# EAGLE schematic H3-Rev_A (EAGLE 9.6.2)
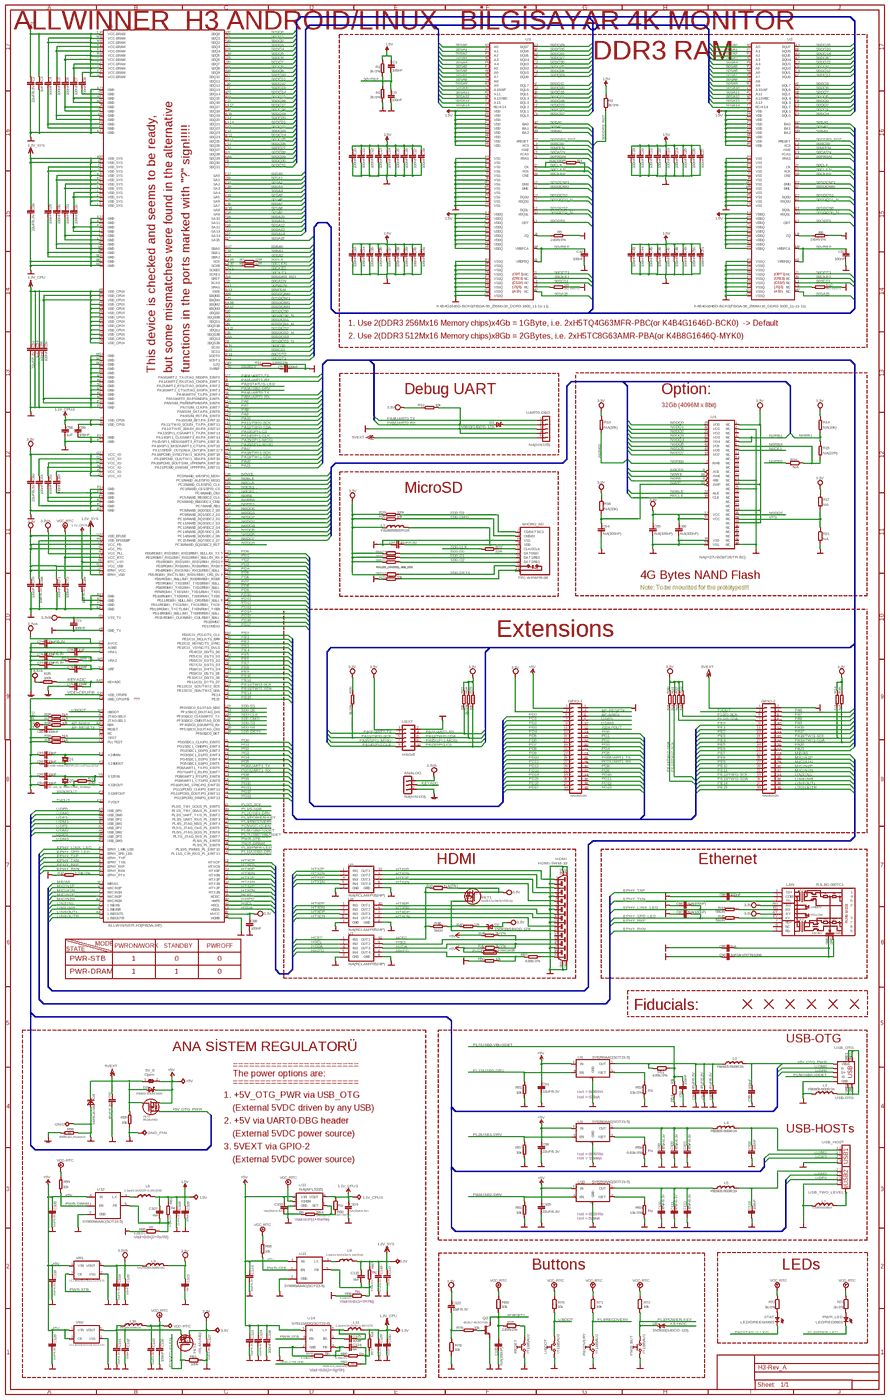
[diagram p0: schematic, sheet 1, overview]
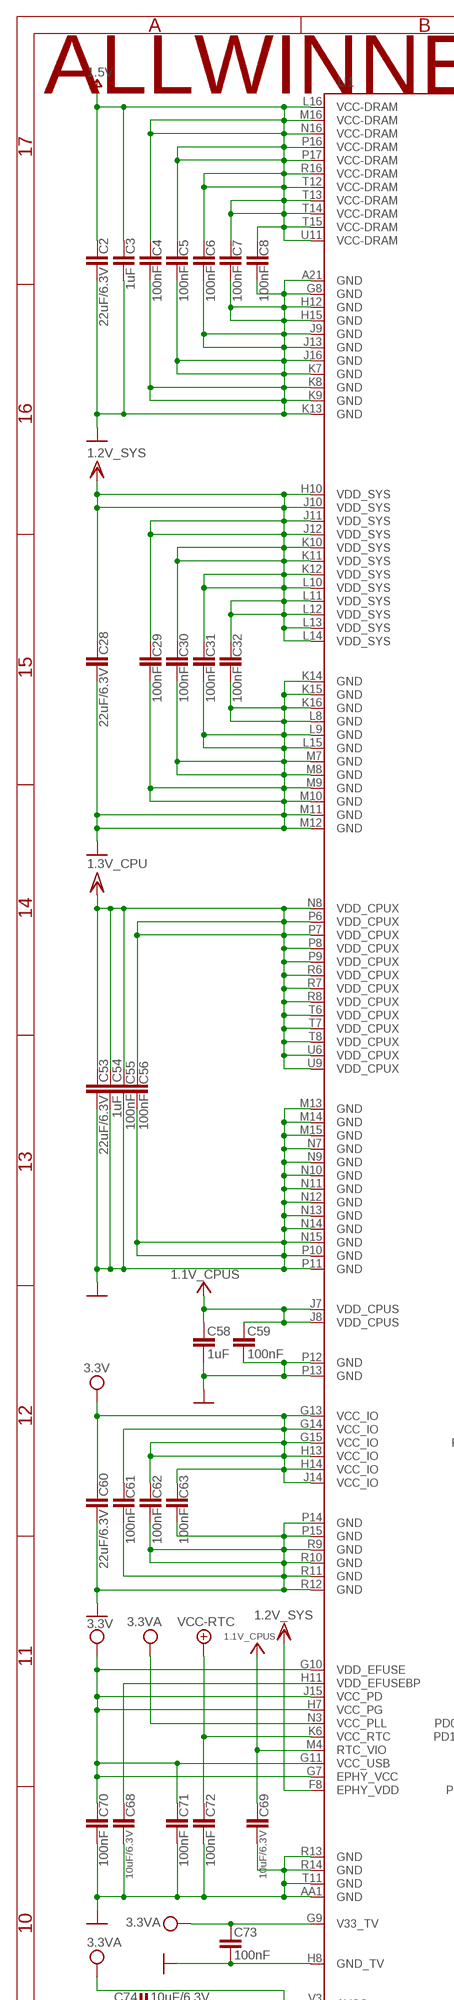
[diagram p1: schematic, sheet 1, part 1 of 4]
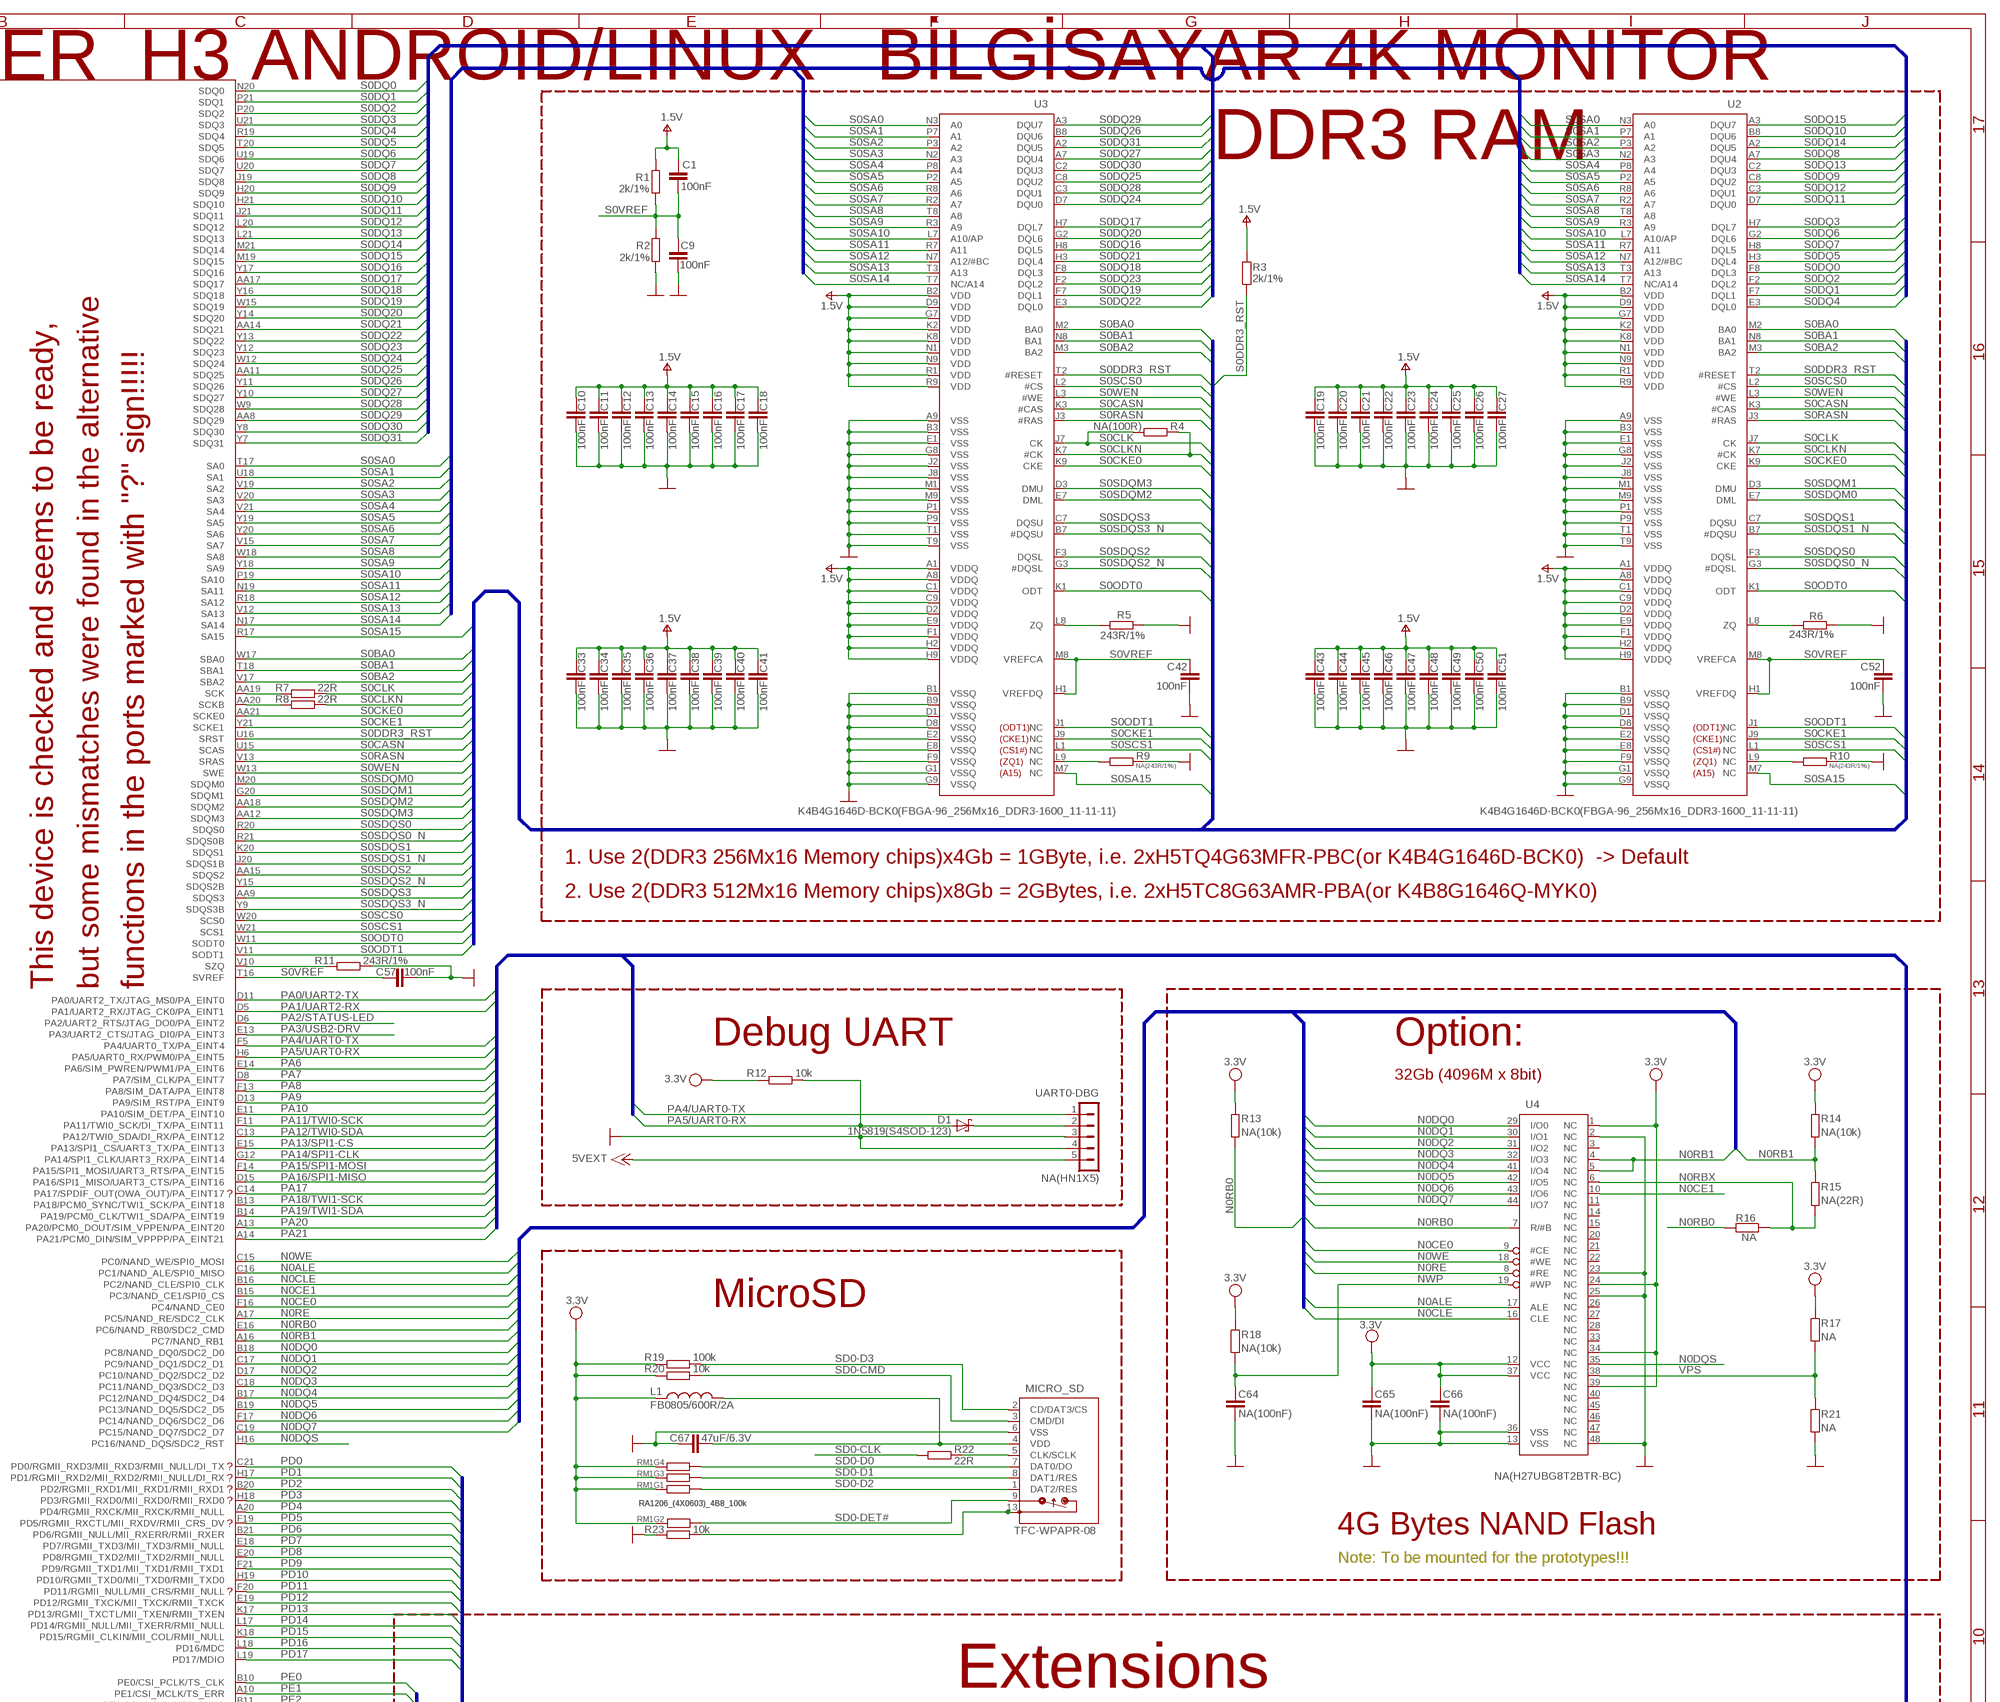
[diagram p2: schematic, sheet 1, part 2 of 4]
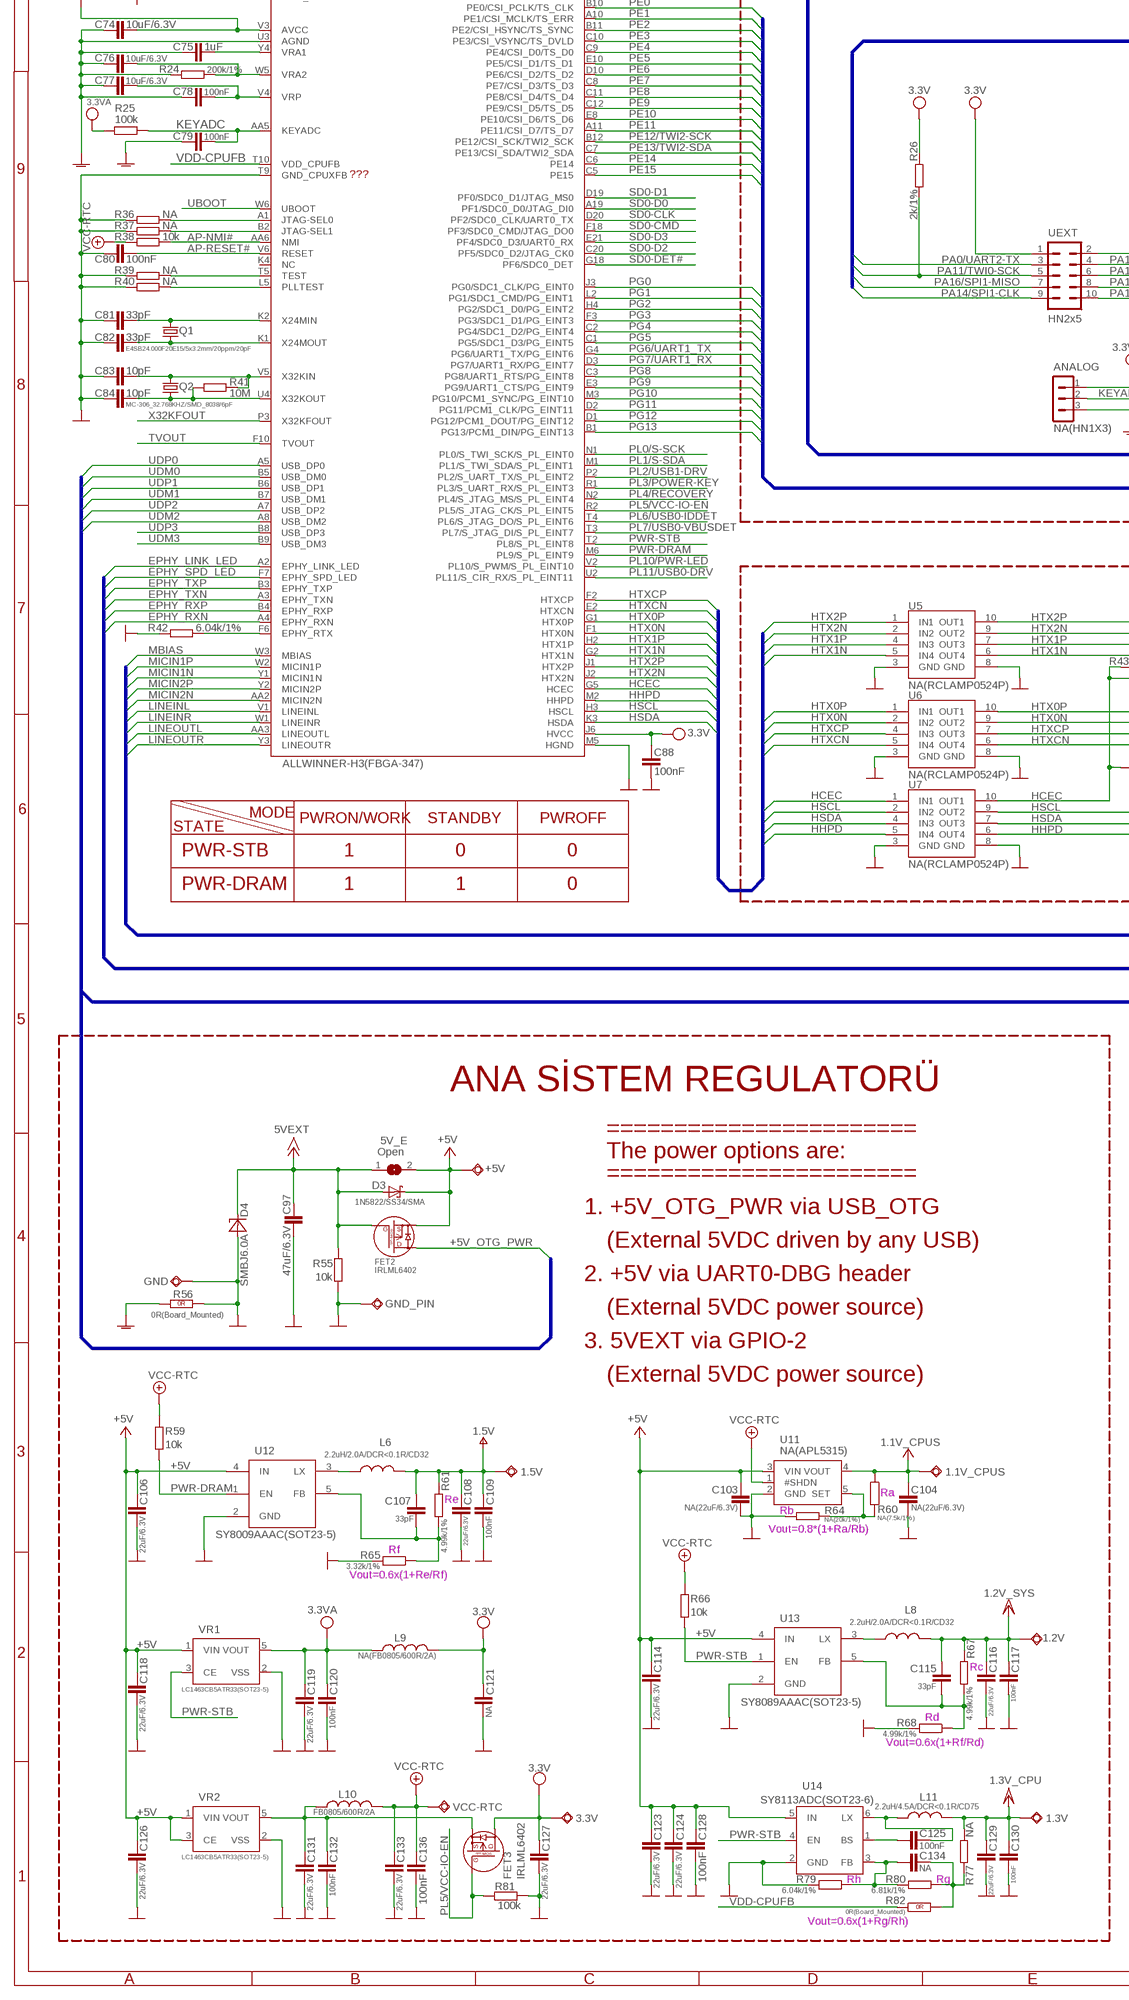
[diagram p3: schematic, sheet 1, part 3 of 4]
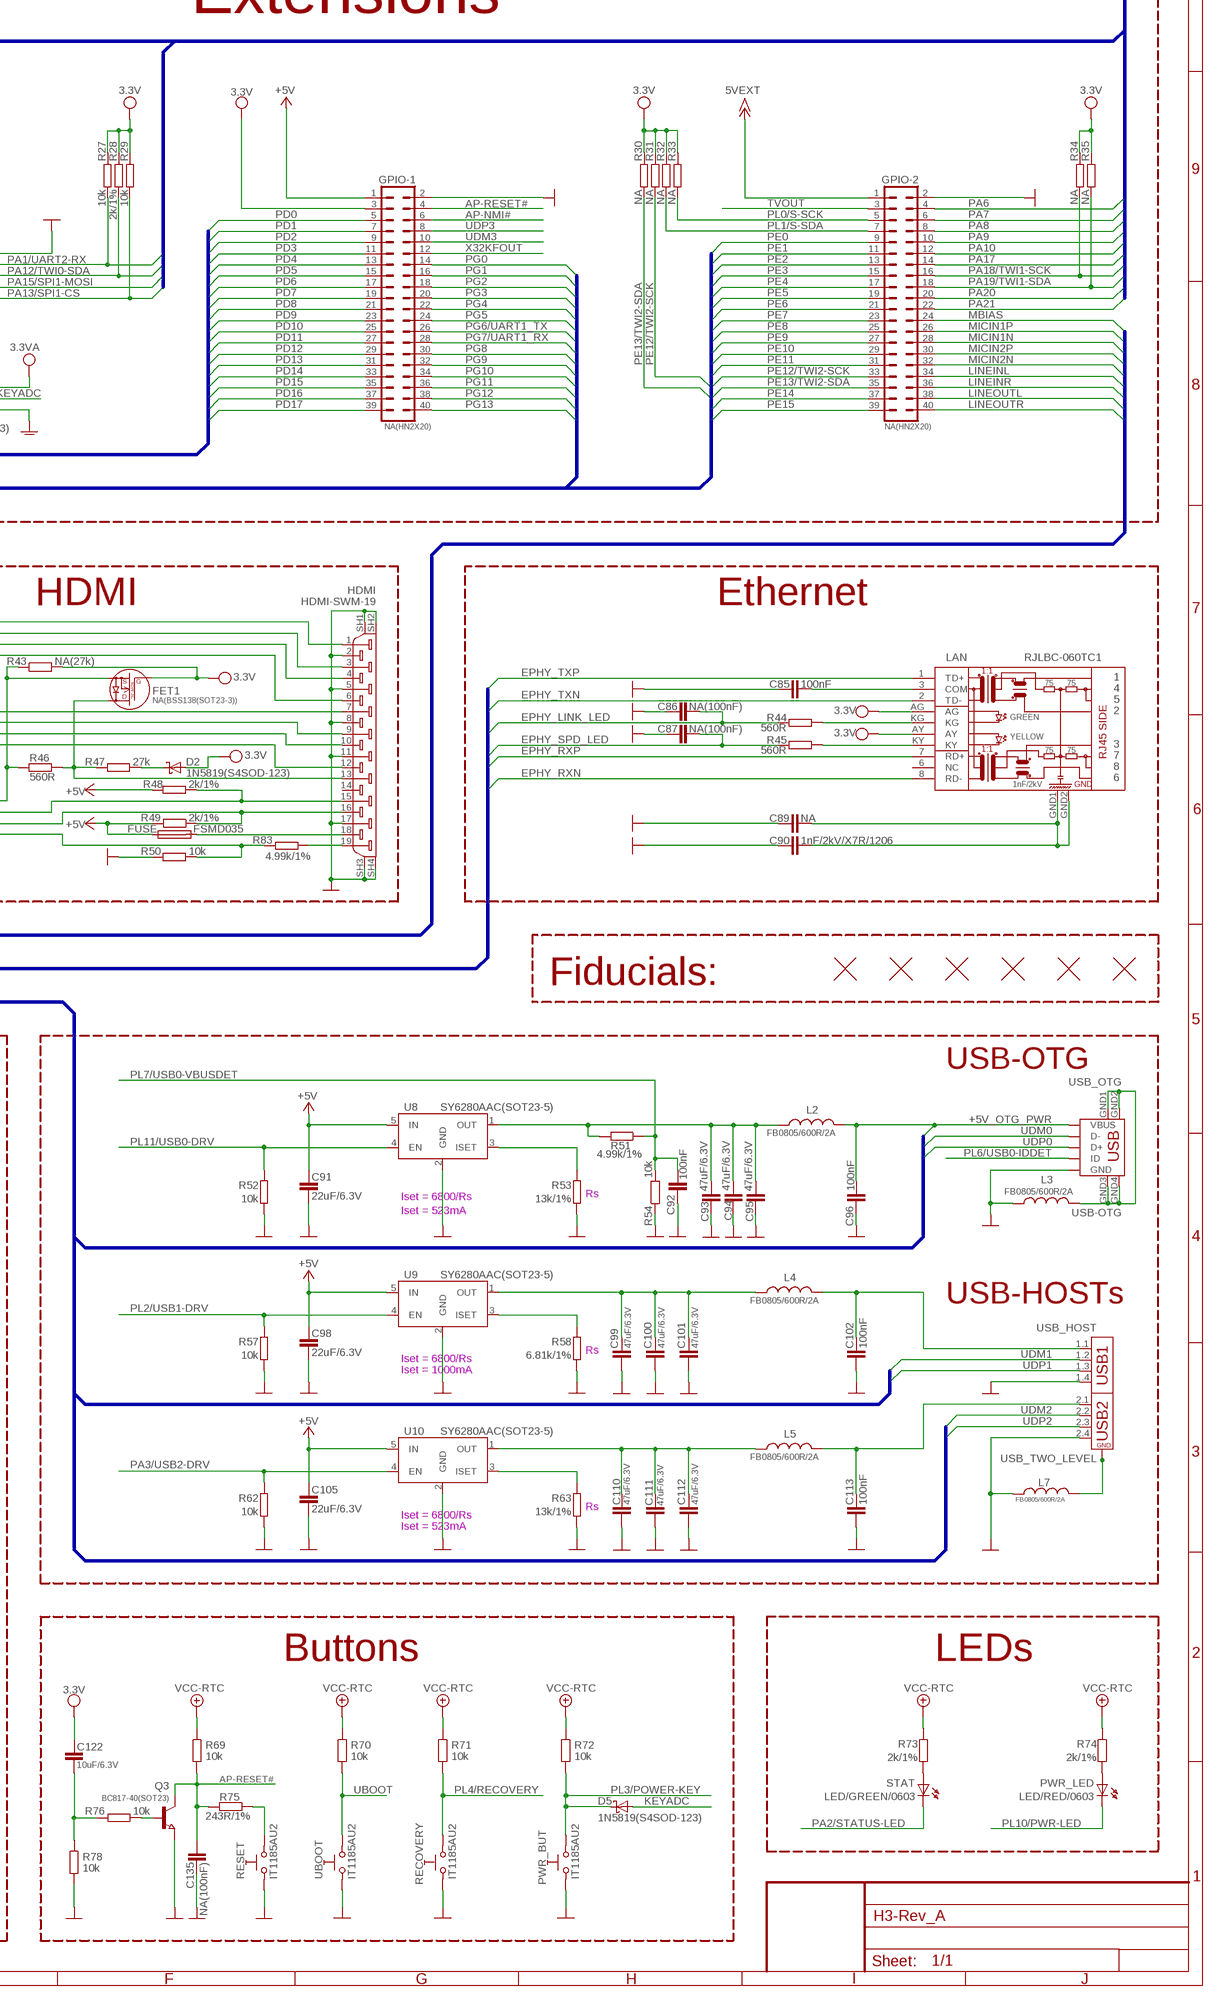
[diagram p4: schematic, sheet 1, part 4 of 4]

## Parts
1.1V_CPUS  TESTPADTESTPAD_40-ROUND  [TESTPAD_40-ROUND]
1.2V  TESTPADTESTPAD_40-ROUND  [TESTPAD_40-ROUND]
1.3V  TESTPADTESTPAD_40-ROUND  [TESTPAD_40-ROUND]
1.5V  TESTPADTESTPAD_40-ROUND  [TESTPAD_40-ROUND]
3.3V  TESTPADTESTPAD_40-ROUND  [TESTPAD_40-ROUND]
5V_E  Open  SJSJ_SMALLER  [SJ_1_SMALLER]
+5V  TESTPADTESTPAD_40-ROUND  [TESTPAD_40-ROUND]
ANALOG  NA(HN1X3)  CON3HN1X3  [HN1X3]
C1  100nF  C-EUC0402_TI  [C0402_TI]
C2  22uF/6.3V  C-EUC0603_DWS  [C0603_DWS]
C3  1uF  C-EUC0603_DWS  [C0603_DWS]
C4  100nF  C-EUC0402_TI  [C0402_TI]
C5  100nF  C-EUC0402_TI  [C0402_TI]
C6  100nF  C-EUC0402_TI  [C0402_TI]
C7  100nF  C-EUC0402_TI  [C0402_TI]
C8  100nF  C-EUC0402_TI  [C0402_TI]
C9  100nF  C-EUC0402_TI  [C0402_TI]
C10  100nF  C-EUC0402_TI  [C0402_TI]
C11  100nF  C-EUC0402_TI  [C0402_TI]
C12  100nF  C-EUC0402_TI  [C0402_TI]
C13  100nF  C-EUC0402_TI  [C0402_TI]
C14  100nF  C-EUC0402_TI  [C0402_TI]
C15  100nF  C-EUC0402_TI  [C0402_TI]
C16  100nF  C-EUC0402_TI  [C0402_TI]
C17  100nF  C-EUC0402_TI  [C0402_TI]
C18  100nF  C-EUC0402_TI  [C0402_TI]
C19  100nF  C-EUC0402_TI  [C0402_TI]
C20  100nF  C-EUC0402_TI  [C0402_TI]
C21  100nF  C-EUC0402_TI  [C0402_TI]
C22  100nF  C-EUC0402_TI  [C0402_TI]
C23  100nF  C-EUC0402_TI  [C0402_TI]
C24  100nF  C-EUC0402_TI  [C0402_TI]
C25  100nF  C-EUC0402_TI  [C0402_TI]
C26  100nF  C-EUC0402_TI  [C0402_TI]
C27  100nF  C-EUC0402_TI  [C0402_TI]
C28  22uF/6.3V  C-EUC0603_DWS  [C0603_DWS]
C29  100nF  C-EUC0402_TI  [C0402_TI]
C30  100nF  C-EUC0402_TI  [C0402_TI]
C31  100nF  C-EUC0402_TI  [C0402_TI]
C32  100nF  C-EUC0402_TI  [C0402_TI]
C33  100nF  C-EUC0402_TI  [C0402_TI]
C34  100nF  C-EUC0402_TI  [C0402_TI]
C35  100nF  C-EUC0402_TI  [C0402_TI]
C36  100nF  C-EUC0402_TI  [C0402_TI]
C37  100nF  C-EUC0402_TI  [C0402_TI]
C38  100nF  C-EUC0402_TI  [C0402_TI]
C39  100nF  C-EUC0402_TI  [C0402_TI]
C40  100nF  C-EUC0402_TI  [C0402_TI]
C41  100nF  C-EUC0402_TI  [C0402_TI]
C42  100nF  C-EUC0402_TI  [C0402_TI]
C43  100nF  C-EUC0402_TI  [C0402_TI]
C44  100nF  C-EUC0402_TI  [C0402_TI]
C45  100nF  C-EUC0402_TI  [C0402_TI]
C46  100nF  C-EUC0402_TI  [C0402_TI]
C47  100nF  C-EUC0402_TI  [C0402_TI]
C48  100nF  C-EUC0402_TI  [C0402_TI]
C49  100nF  C-EUC0402_TI  [C0402_TI]
C50  100nF  C-EUC0402_TI  [C0402_TI]
C51  100nF  C-EUC0402_TI  [C0402_TI]
C52  100nF  C-EUC0402_TI  [C0402_TI]
C53  22uF/6.3V  C-EUC0603_DWS  [C0603_DWS]
C54  1uF  C-EUC0603_DWS  [C0603_DWS]
C55  100nF  C-EUC0402_TI  [C0402_TI]
C56  100nF  C-EUC0402_TI  [C0402_TI]
C57  100nF  C-EUC0402_TI  [C0402_TI]
C58  1uF  C-EUC0603_DWS  [C0603_DWS]
C59  100nF  C-EUC0402_TI  [C0402_TI]
C60  22uF/6.3V  C-EUC0603_DWS  [C0603_DWS]
C61  100nF  C-EUC0402_TI  [C0402_TI]
C62  100nF  C-EUC0402_TI  [C0402_TI]
C63  100nF  C-EUC0402_TI  [C0402_TI]
C64  NA(100nF)  C-EUC0402_TI  [C0402_TI]
C65  NA(100nF)  C-EUC0402_TI  [C0402_TI]
C66  NA(100nF)  C-EUC0402_TI  [C0402_TI]
C67  47uF/6.3V  C-EUC0805_5MIL_DWS  [C0805_5MIL_DWS]
C68  10uF/6.3V  C-EUC0603_DWS  [C0603_DWS]
C69  10uF/6.3V  C-EUC0603_DWS  [C0603_DWS]
C70  100nF  C-EUC0402_TI  [C0402_TI]
C71  100nF  C-EUC0402_TI  [C0402_TI]
C72  100nF  C-EUC0402_TI  [C0402_TI]
C73  100nF  C-EUC0402_TI  [C0402_TI]
C74  10uF/6.3V  C-EUC0603_DWS  [C0603_DWS]
C75  1uF  C-EUC0603_DWS  [C0603_DWS]
C76  10uF/6.3V  C-EUC0603_DWS  [C0603_DWS]
C77  10uF/6.3V  C-EUC0603_DWS  [C0603_DWS]
C78  100nF  C-EUC0402_TI  [C0402_TI]
C79  100nF  C-EUC0402_TI  [C0402_TI]
C80  100nF  C-EUC0402_TI  [C0402_TI]
C81  33pF  C-EUC0603_DWS  [C0603_DWS]
C82  33pF  C-EUC0603_DWS  [C0603_DWS]
C83  10pF  C-EUC0603_DWS  [C0603_DWS]
C84  10pF  C-EUC0603_DWS  [C0603_DWS]
C85  100nF  C-EUC0402_TI  [C0402_TI]
C86  NA(100nF)  C-EUC0402_TI  [C0402_TI]
C87  NA(100nF)  C-EUC0402_TI  [C0402_TI]
C88  100nF  C-EUC0402_TI  [C0402_TI]
C89  NA  C-EUC1206_5MILS_WS_ISO  [C1206_5MILS_WS_ISO]
C90  1nF/2kV/X7R/1206  C-EUC1206_5MILS_WS_ISO  [C1206_5MILS_WS_ISO]
C91  22uF/6.3V  C-EUC0603_DWS  [C0603_DWS]
C92  100nF  C-EUC0402_TI  [C0402_TI]
C93  47uF/6.3V  C-EUC0805_5MIL_DWS  [C0805_5MIL_DWS]
C94  47uF/6.3V  C-EUC0805_5MIL_DWS  [C0805_5MIL_DWS]
C95  47uF/6.3V  C-EUC0805_5MIL_DWS  [C0805_5MIL_DWS]
C96  100nF  C-EUC0402_TI  [C0402_TI]
C97  47uF/6.3V  C-EUC0805_5MIL_DWS  [C0805_5MIL_DWS]
C98  22uF/6.3V  C-EUC0603_DWS  [C0603_DWS]
C99  47uF/6.3V  C-EUC0805_5MIL_DWS  [C0805_5MIL_DWS]
C100  47uF/6.3V  C-EUC0805_5MIL_DWS  [C0805_5MIL_DWS]
C101  47uF/6.3V  C-EUC0805_5MIL_DWS  [C0805_5MIL_DWS]
C102  100nF  C-EUC0402_TI  [C0402_TI]
C103  NA(22uF/6.3V)  C-EUC0603_DWS  [C0603_DWS]
C104  NA(22uF/6.3V)  C-EUC0603_DWS  [C0603_DWS]
C105  22uF/6.3V  C-EUC0603_DWS  [C0603_DWS]
C106  22uF/6.3V  C-EUC0603_DWS  [C0603_DWS]
C107  33pF  C-EUC0603_DWS  [C0603_DWS]
C108  22uF/6.3V  C-EUC0603_DWS  [C0603_DWS]
C109  100nF  C-EUC0402_TI  [C0402_TI]
C110  47uF/6.3V  C-EUC0805_5MIL_DWS  [C0805_5MIL_DWS]
C111  47uF/6.3V  C-EUC0805_5MIL_DWS  [C0805_5MIL_DWS]
C112  47uF/6.3V  C-EUC0805_5MIL_DWS  [C0805_5MIL_DWS]
C113  100nF  C-EUC0402_TI  [C0402_TI]
C114  22uF/6.3V  C-EUC0603_DWS  [C0603_DWS]
C115  33pF  C-EUC0603_DWS  [C0603_DWS]
C116  22uF/6.3V  C-EUC0603_DWS  [C0603_DWS]
C117  100nF  C-EUC0402_TI  [C0402_TI]
C118  22uF/6.3V  C-EUC0603_DWS  [C0603_DWS]
C119  22uF/6.3V  C-EUC0603_DWS  [C0603_DWS]
C120  100nF  C-EUC0402_TI  [C0402_TI]
C121  NA  C-EUC0603_DWS  [C0603_DWS]
C122  10uF/6.3V  C-EUC0603_DWS  [C0603_DWS]
C123  22uF/6.3V  C-EUC0603_DWS  [C0603_DWS]
C124  22uF/6.3V  C-EUC0603_DWS  [C0603_DWS]
C125  100nF  C-EUC0402_TI  [C0402_TI]
C126  22uF/6.3V  C-EUC0603_DWS  [C0603_DWS]
C127  22uF/6.3V  C-EUC0603_DWS  [C0603_DWS]
C128  100nF  C-EUC0402_TI  [C0402_TI]
C129  22uF/6.3V  C-EUC0603_DWS  [C0603_DWS]
C130  100nF  C-EUC0402_TI  [C0402_TI]
C131  22uF/6.3V  C-EUC0603_DWS  [C0603_DWS]
C132  100nF  C-EUC0402_TI  [C0402_TI]
C133  22uF/6.3V  C-EUC0603_DWS  [C0603_DWS]
C134  NA  C-EUC0603_DWS  [C0603_DWS]
C135  NA(100nF)  C-EUC0402_TI  [C0402_TI]
C136  100nF  C-EUC0402_TI  [C0402_TI]
D1  1N5819(S4SOD-123)  SCHOTKKY7.62SS-1N5819(S4SOD-123)  [SOD-123]
D2  1N5819(S4SOD-123)  SCHOTKKY7.62SS-1N5819(S4SOD-123)  [SOD-123]
D3  1N5822/SS34/SMA  SCHOTKKY7.62SS2  [MLL-41]
D4  SMBJ6.0A  SMBJ16A  [DO214AA]
D5  1N5819(S4SOD-123)  SCHOTKKY7.62SS-1N5819(S4SOD-123)  [SOD-123]
FET1  NA(BSS138(SOT23-3))  N-MOS+DIODBSS138(SOT23-3)  [SOT23]
FET2  IRLML6402  P-MOS+DIODIRLML6402  [SOT23]
FET3  IRLML6402  P-MOS+DIODIRLML6402  [SOT23]
FID1  FIDUCIAL  [FIDUCIAL-1X3]
FID2  FIDUCIAL  [FIDUCIAL-1X3]
FID3  FIDUCIAL  [FIDUCIAL-1X3]
FID4  FIDUCIAL  [FIDUCIAL-1X3]
FID5  FIDUCIAL  [FIDUCIAL-1X3]
FID6  FIDUCIAL  [FIDUCIAL-1X3]
FUSE  FSMD035  FUSE  [1206]
GND  TESTPADTESTPAD_40-ROUND  [TESTPAD_40-ROUND]
GND_PIN  TESTPAD3  [TEST_PAD40/70/SQUARE]
GPIO-1  NA(HN2X20)  ML40HN2X20  [HN2X20-MALE]
GPIO-2  NA(HN2X20)  ML40HN2X20  [HN2X20-MALE]
HDMI  HDMI-SWM-19  HDMI-MC34931HDMI-SWM-19  [HDMI-SWM-19]
L1  FB0805/600R/2A  L-USL0805_5MIL_DWS  [L0805_5MIL_DWS]
L2  FB0805/600R/2A  L-USL0805_5MIL_DWS  [L0805_5MIL_DWS]
L3  FB0805/600R/2A  L-USL0805_5MIL_DWS  [L0805_5MIL_DWS]
L4  FB0805/600R/2A  L-USL0805_5MIL_DWS  [L0805_5MIL_DWS]
L5  FB0805/600R/2A  L-USL0805_5MIL_DWS  [L0805_5MIL_DWS]
L6  2.2uH/2.0A/DCR<0.1R/CD32  L-CD32  [CD32]
L7  FB0805/600R/2A  L-USL0805_5MIL_DWS  [L0805_5MIL_DWS]
L8  2.2uH/2.0A/DCR<0.1R/CD32  L-CD32  [CD32]
L9  NA(FB0805/600R/2A)  L-USL0805_5MIL_DWS  [L0805_5MIL_DWS]
L10  FB0805/600R/2A  L-USL0805_5MIL_DWS  [L0805_5MIL_DWS]
L11  2.2uH/4.5A/DCR<0.1R/CD75  L-CD73(75)  [CD73(75)]
LAN  RJLBC-060TC1  RJLBC-060TC1_GND_MILLING  [RJLBC-060TC1_MILLING]
MICRO_SD  TFC-WPAPR-08  MICRO_SD/MMC_CP_NEWTFC-WPAPR-08  [TFC-WPAPR-08]
PWR_BUT  IT1185AU2  SW-TAKTIT1185AU2  [IT1185AU2]
PWR_LED  LED/RED/0603  LEDLED-0603_TEST  [LED-0603_TEST]
Q1  E4SB24.000F20E15/5x3.2mm/20ppm/20pF  HC49/S_E4SB25.000F20E15  [HCX-4S]
Q2  MC-306_32.768KHZ/SMD_8038/6pF  HC49/S_32768HZ/6PF  [MC-306]
Q3  BC817-40(SOT23)  NPN-TRANSISTOR_SOT23  [SOT23]
R1  2k/1%  R-EU_R0603_5MIL_DWS  [R0603_5MIL_DWS]
R2  2k/1%  R-EU_R0603_5MIL_DWS  [R0603_5MIL_DWS]
R3  2k/1%  R-EU_R0603_5MIL_DWS  [R0603_5MIL_DWS]
R4  NA(100R)  R-EU_R0402_TI  [R0402_TI]
R5  243R/1%  R-EU_R0603_5MIL_DWS  [R0603_5MIL_DWS]
R6  243R/1%  R-EU_R0603_5MIL_DWS  [R0603_5MIL_DWS]
R7  22R  R-EU_R0402_TI  [R0402_TI]
R8  22R  R-EU_R0402_TI  [R0402_TI]
R9  NA(243R/1%)  R-EU_R0603_5MIL_DWS  [R0603_5MIL_DWS]
R10  NA(243R/1%)  R-EU_R0603_5MIL_DWS  [R0603_5MIL_DWS]
R11  243R/1%  R-EU_R0603_5MIL_DWS  [R0603_5MIL_DWS]
R12  10k  R-EU_R0603_5MIL_DWS  [R0603_5MIL_DWS]
R13  NA(10k)  R-EU_R0603_5MIL_DWS  [R0603_5MIL_DWS]
R14  NA(10k)  R-EU_R0603_5MIL_DWS  [R0603_5MIL_DWS]
R15  NA(22R)  R-EU_R0402_TI  [R0402_TI]
R16  NA  R-EU_R0603_5MIL_DWS  [R0603_5MIL_DWS]
R17  NA  R-EU_R0603_5MIL_DWS  [R0603_5MIL_DWS]
R18  NA(10k)  R-EU_R0603_5MIL_DWS  [R0603_5MIL_DWS]
R19  100k  R-EU_R0603_5MIL_DWS  [R0603_5MIL_DWS]
R20  10k  R-EU_R0603_5MIL_DWS  [R0603_5MIL_DWS]
R21  NA  R-EU_R0603_5MIL_DWS  [R0603_5MIL_DWS]
R22  22R  R-EU_R0402_TI  [R0402_TI]
R23  10k  R-EU_R0603_5MIL_DWS  [R0603_5MIL_DWS]
R24  200k/1%  R-EU_R0603_5MIL_DWS  [R0603_5MIL_DWS]
R25  100k  R-EU_R0603_5MIL_DWS  [R0603_5MIL_DWS]
R26  2k/1%  R-EU_R0603_5MIL_DWS  [R0603_5MIL_DWS]
R27  10k  R-EU_R0603_5MIL_DWS  [R0603_5MIL_DWS]
R28  2k/1%  R-EU_R0603_5MIL_DWS  [R0603_5MIL_DWS]
R29  10k  R-EU_R0603_5MIL_DWS  [R0603_5MIL_DWS]
R30  NA  R-EU_R0603_5MIL_DWS  [R0603_5MIL_DWS]
R31  NA  R-EU_R0603_5MIL_DWS  [R0603_5MIL_DWS]
R32  NA  R-EU_R0603_5MIL_DWS  [R0603_5MIL_DWS]
R33  NA  R-EU_R0603_5MIL_DWS  [R0603_5MIL_DWS]
R34  NA  R-EU_R0603_5MIL_DWS  [R0603_5MIL_DWS]
R35  NA  R-EU_R0603_5MIL_DWS  [R0603_5MIL_DWS]
R36  NA  R-EU_R0603_5MIL_DWS  [R0603_5MIL_DWS]
R37  NA  R-EU_R0603_5MIL_DWS  [R0603_5MIL_DWS]
R38  10k  R-EU_R0603_5MIL_DWS  [R0603_5MIL_DWS]
R39  NA  R-EU_R0603_5MIL_DWS  [R0603_5MIL_DWS]
R40  NA  R-EU_R0603_5MIL_DWS  [R0603_5MIL_DWS]
R41  10M  R-EU_R0603_5MIL_DWS  [R0603_5MIL_DWS]
R42  6.04k/1%  R-EU_R0603_5MIL_DWS  [R0603_5MIL_DWS]
R43  NA(27k)  R-EU_R0603_5MIL_DWS  [R0603_5MIL_DWS]
R44  560R  R-EU_R0603_5MIL_DWS  [R0603_5MIL_DWS]
R45  560R  R-EU_R0603_5MIL_DWS  [R0603_5MIL_DWS]
R46  560R  R-EU_R0603_5MIL_DWS  [R0603_5MIL_DWS]
R47  27k  R-EU_R0603_5MIL_DWS  [R0603_5MIL_DWS]
R48  2k/1%  R-EU_R0603_5MIL_DWS  [R0603_5MIL_DWS]
R49  2k/1%  R-EU_R0603_5MIL_DWS  [R0603_5MIL_DWS]
R50  10k  R-EU_R0603_5MIL_DWS  [R0603_5MIL_DWS]
R51  4.99k/1%  R-EU_R0603_5MIL_DWS  [R0603_5MIL_DWS]
R52  10k  R-EU_R0603_5MIL_DWS  [R0603_5MIL_DWS]
R53  13k/1%  R-EU_R0603_5MIL_DWS  [R0603_5MIL_DWS]
R54  10k  R-EU_R0603_5MIL_DWS  [R0603_5MIL_DWS]
R55  10k  R-EU_R0603_5MIL_DWS  [R0603_5MIL_DWS]
R56  0R(Board_Mounted)  R_0R0R(NA)  [0603_0R]
R57  10k  R-EU_R0603_5MIL_DWS  [R0603_5MIL_DWS]
R58  6.81k/1%  R-EU_R0603_5MIL_DWS  [R0603_5MIL_DWS]
R59  10k  R-EU_R0603_5MIL_DWS  [R0603_5MIL_DWS]
R60  NA(7.5k/1%)  R-EU_R0603_5MIL_DWS  [R0603_5MIL_DWS]
R61  4.99k/1%  R-EU_R0603_5MIL_DWS  [R0603_5MIL_DWS]
R62  10k  R-EU_R0603_5MIL_DWS  [R0603_5MIL_DWS]
R63  13k/1%  R-EU_R0603_5MIL_DWS  [R0603_5MIL_DWS]
R64  NA(20k/1%)  R-EU_R0603_5MIL_DWS  [R0603_5MIL_DWS]
R65  3.32k/1%  R-EU_R0603_5MIL_DWS  [R0603_5MIL_DWS]
R66  10k  R-EU_R0603_5MIL_DWS  [R0603_5MIL_DWS]
R67  4.99k/1%  R-EU_R0603_5MIL_DWS  [R0603_5MIL_DWS]
R68  4.99k/1%  R-EU_R0603_5MIL_DWS  [R0603_5MIL_DWS]
R69  10k  R-EU_R0603_5MIL_DWS  [R0603_5MIL_DWS]
R70  10k  R-EU_R0603_5MIL_DWS  [R0603_5MIL_DWS]
R71  10k  R-EU_R0603_5MIL_DWS  [R0603_5MIL_DWS]
R72  10k  R-EU_R0603_5MIL_DWS  [R0603_5MIL_DWS]
R73  2k/1%  R-EU_R0603_5MIL_DWS  [R0603_5MIL_DWS]
R74  2k/1%  R-EU_R0603_5MIL_DWS  [R0603_5MIL_DWS]
R75  243R/1%  R-EU_R0603_5MIL_DWS  [R0603_5MIL_DWS]
R76  10k  R-EU_R0603_5MIL_DWS  [R0603_5MIL_DWS]
R77  NA  R-EU_R0603_5MIL_DWS  [R0603_5MIL_DWS]
R78  10k  R-EU_R0603_5MIL_DWS  [R0603_5MIL_DWS]
R79  6.04k/1%  R-EU_R0603_5MIL_DWS  [R0603_5MIL_DWS]
R80  6.81k/1%  R-EU_R0603_5MIL_DWS  [R0603_5MIL_DWS]
R81  100k  R-EU_R0603_5MIL_DWS  [R0603_5MIL_DWS]
R82  0R(Board_Mounted)  R_0R0R(NA)  [0603_0R]
R83  4.99k/1%  R-EU_R0603_5MIL_DWS  [R0603_5MIL_DWS]
RECOVERY  IT1185AU2  SW-TAKTIT1185AU2  [IT1185AU2]
RESET  IT1185AU2  SW-TAKTIT1185AU2  [IT1185AU2]
RM1  RA1206_(4X0603)_4B8_100k  R_MATRIX_4E  [R_MATRIX_4]
STAT  LED/GREEN/0603  LEDLED-0603_TEST  [LED-0603_TEST]
U1  ALLWINNER-H3(FBGA-347)  [FBGA-347]
U2  K4B4G1646D-BCK0(FBGA-96_256Mx16_DDR3-1600_11-11-11)  H5TQ2G63BFR_MEM4G16D3EABG-125--H5TC8G63AMR-PBA_K4B8G1646Q-MYK0(FBGA-96_512MX16_DDR3-1600_11-11-11)  [FBGA96(HYNIX_SAMSUNG_512MX16_DDR3)]
U3  K4B4G1646D-BCK0(FBGA-96_256Mx16_DDR3-1600_11-11-11)  H5TQ2G63BFR_MEM4G16D3EABG-125--H5TC8G63AMR-PBA_K4B8G1646Q-MYK0(FBGA-96_512MX16_DDR3-1600_11-11-11)  [FBGA96(HYNIX_SAMSUNG_512MX16_DDR3)]
U4  NA(H27UBG8T2BTR-BC)  H27UBG8T2A  [TSOP48]
U5  NA(RCLAMP0524P)  RCLAMP0524P  [SLP2510P8]
U6  NA(RCLAMP0524P)  RCLAMP0524P  [SLP2510P8]
U7  NA(RCLAMP0524P)  RCLAMP0524P  [SLP2510P8]
U8  SY6280AAC(SOT23-5)  SY6280  [SOT23-5]
U9  SY6280AAC(SOT23-5)  SY6280  [SOT23-5]
U10  SY6280AAC(SOT23-5)  SY6280  [SOT23-5]
U11  NA(APL5315)  APL5315  [SOT-23-5]
U12  SY8009AAAC(SOT23-5)  SY8008  [SOT23-5]
U13  SY8089AAAC(SOT23-5)  SY8008  [SOT23-5]
U14  SY8113ADC(SOT23-6)  [SOT23-6]
UART0-DBG  NA(HN1X5)  CON5HN1X5  [HN1X5]
UBOOT  IT1185AU2  SW-TAKTIT1185AU2  [IT1185AU2]
UEXT  HN2x5  ML10ML10_NEW  [ML10_NEW]
USB_HOST  USB_TWO_LEVEL  [USB_TWO_LEVEL]
USB_OTG  USB-OTG  MINI_USB9  [USB_MINI_9PIN]
VCC-RTC  TESTPADTESTPAD_40-ROUND  [TESTPAD_40-ROUND]
VR1  LC1463CB5ATR33(SOT23-5)  AP1231-33  [SOT-23-5]
VR2  LC1463CB5ATR33(SOT23-5)  AP1231-33  [SOT-23-5]

## Nets
+5V: 5V_E.2 +5V.1(PP) C91.1 C98.1 C103.1 C105.1 C106.1 C114.1 C118.1 C123.1 C124.1 C126.1 C128.2 D3.K(C) FET2.2(S) FUSE.1 GPIO-1.1 R48.2 R49.2 U8.5(IN) U9.5(IN) U10.5(IN) U11.3(VIN) U12.4(IN) U13.4(IN) U14.5(IN) VR1.1(VIN) VR2.1(VIN) VR2.3(CE)
+5V_OTG_PWR: C96.1 FET2.3(D) L2.1 USB_OTG.VBUS
+7V: C72.2 C133.1 C136.2 L10.2 R38.2 R59.1 R66.1 R69.1 R70.1 R71.1 R72.1 R73.1 R74.1 U1.K6(VCC_RTC) U11.1(#SHDN) VCC-RTC.1(PP) ; supply symbol labelled VCC-RTC
+15V: 5V_E.1 C97.1 D3.A D4.C FET2.1(G) GPIO-2.1 R55.2 UART0-DBG.5 ; supply symbol labelled 5VEXT
AP-NMI#: GPIO-1.6 R38.1 U1.AA6(NMI)
AP-RESET#: C80.2 C135.2 GPIO-1.4 Q3.3(C) R69.2 R75.2 U1.V6(RESET)
EPHY_LINK_LED: C86.2 R44.2 U1.A2(EPHY_LINK_LED)
EPHY_RXN: LAN.8(RD-) U1.A4(EPHY_RXN)
EPHY_RXP: LAN.7(RD+) U1.B4(EPHY_RXP)
EPHY_SPD_LED: C87.2 R45.2 U1.F7(EPHY_SPD_LED)
EPHY_TXN: LAN.2(TD-) U1.A3(EPHY_TXN)
EPHY_TXP: LAN.1(TD+) U1.B3(EPHY_TXP)
GND [pwr]: C2.2 C3.2 C4.1 C5.1 C6.1 C7.1 C8.1 C9.1 C10.1 C11.1 C12.1 C13.1 C14.1 C15.1 C16.1 C17.1 C18.1 C19.1 C20.1 C21.1 C22.1 C23.1 C24.1 C25.1 C26.1 C27.1 C28.2 C29.1 C30.1 C31.1 C32.1 C33.1 C34.1 C35.1 C36.1 C37.1 C38.1 C39.1 C40.1 C41.1 C42.1 C43.1 C44.1 C45.1 C46.1 C47.1 C48.1 C49.1 C50.1 C51.1 C52.1 C53.2 C54.2 C55.1 C56.1 C57.1 C58.2 C59.1 C60.2 C61.1 C62.1 C63.1 C64.1 C65.1 C66.1 C67.1 C68.2 C69.2 C70.1 C71.1 C72.1 C73.1 C80.1 C81.1 C82.1 C83.1 C84.1 C85.1 C86.1 C87.1 C88.1 C89.1 C90.1 C91.2 C92.2 C93.2 C94.2 C95.2 C96.2 C97.2 C98.2 C99.2 C100.2 C101.2 C102.2 C103.2 C104.2 C105.2 C106.2 C108.2 C109.2 C110.2 C111.2 C112.2 C113.2 C114.2 C116.2 C117.2 C118.2 C119.2 C120.2 C121.2 C123.2 C124.2 C126.2 C127.2 C128.1 C129.2 C130.2 C131.2 C132.2 C133.2 C135.1 C136.1 D4.A GND.1(PP) GND_PIN.P$1(PP) GPIO-1.2 GPIO-2.2 HDMI.2 HDMI.5 HDMI.8 HDMI.11 HDMI.17 HDMI.SH1 HDMI.SH2 HDMI.SH3 HDMI.SH4 L3.1 L7.1 MICRO_SD.6(VSS) PWR_BUT.2 Q3.2(E) R2.1 R5.1 R6.1 R9.1 R10.1 R11.1 R21.2 R23.2 R36.2 R37.2 R39.2 R40.2 R42.2 R50.2 R52.1 R53.1 R54.1 R55.1 R56.1(1.1) R57.1 R58.1 R62.1 R63.1 R64.1 R65.2 R68.2 R78.2 R79.2 R81.2 RECOVERY.2 RESET.2 U1.A21(GND) U1.AA1(GND) U1.G8(GND) U1.H8(GND_TV) U1.H12(GND) U1.H15(GND) U1.J9(GND) U1.J13(GND) U1.J16(GND) U1.K7(GND) U1.K8(GND) U1.K9(GND) U1.K13(GND) U1.K14(GND) U1.K15(GND) U1.K16(GND) U1.L8(GND) U1.L9(GND) U1.L15(GND) U1.M5(HGND) U1.M7(GND) U1.M8(GND) U1.M9(GND) U1.M10(GND) U1.M11(GND) U1.M12(GND) U1.M13(GND) U1.M14(GND) U1.M15(GND) U1.N7(GND) U1.N9(GND) U1.N10(GND) U1.N11(GND) U1.N12(GND) U1.N13(GND) U1.N14(GND) U1.N15(GND) U1.P10(GND) U1.P11(GND) U1.P12(GND) U1.P13(GND) U1.P14(GND) U1.P15(GND) U1.R9(GND) U1.R10(GND) U1.R11(GND) U1.R12(GND) U1.R13(GND) U1.R14(GND) U1.T9(GND_CPUXFB) U1.T11(GND) U2.A9(VSS) U2.B1(VSSQ) U2.B3(VSS) U2.B9(VSSQ) U2.D1(VSSQ) U2.D8(VSSQ) U2.E1(VSS) U2.E2(VSSQ) U2.E8(VSSQ) U2.F9(VSSQ) U2.G1(VSSQ) U2.G8(VSS) U2.G9(VSSQ) U2.J2(VSS) U2.J8(VSS) U2.M1(VSS) U2.M9(VSS) U2.P1(VSS) U2.P9(VSS) U2.T1(VSS) U2.T9(VSS) U3.A9(VSS) U3.B1(VSSQ) U3.B3(VSS) U3.B9(VSSQ) U3.D1(VSSQ) U3.D8(VSSQ) U3.E1(VSS) U3.E2(VSSQ) U3.E8(VSSQ) U3.F9(VSSQ) U3.G1(VSSQ) U3.G8(VSS) U3.G9(VSSQ) U3.J2(VSS) U3.J8(VSS) U3.M1(VSS) U3.M9(VSS) U3.P1(VSS) U3.P9(VSS) U3.T1(VSS) U3.T9(VSS) U4.2(NC) U4.13(VSS) U4.23(NC) U4.25(NC) U4.36(VSS) U4.48(NC) U5.3(GND) U5.8(GND) U6.3(GND) U6.8(GND) U7.3(GND) U7.8(GND) U8.2(GND) U9.2(GND) U10.2(GND) U11.2(GND) U12.2(GND) U13.2(GND) U14.2(GND) UART0-DBG.3 UART0-DBG.4 UBOOT.2 UEXT.2 USB_HOST.1.4 USB_HOST.2.4 USB_OTG.GND VR1.2(VSS) VR2.2(VSS)
GNDA: ANALOG.3 C74.1 C75.1 C76.1 C77.1 C78.1 C79.1 R24.2 R56.2(1.2) U1.U3(AGND)
HCEC: FET1.2(S) R43.1 R46.2 U1.G5(HCEC) U7.1(IN1) U7.10(OUT1)
HDMI_5V_SOURCE: FUSE.2 HDMI.18
HHPD: R50.1 R83.1 U1.M2(HHPD) U7.5(IN4) U7.6(OUT4)
HSCL: HDMI.15 R48.1 U1.H3(HSCL) U7.2(IN2) U7.9(OUT2)
HSDA: HDMI.16 R49.1 U1.K3(HSDA) U7.4(IN3) U7.7(OUT3)
HTX0N: HDMI.9 U1.F1(HTX0N) U6.2(IN2) U6.9(OUT2)
HTX0P: HDMI.7 U1.G1(HTX0P) U6.1(IN1) U6.10(OUT1)
HTX1N: HDMI.6 U1.G2(HTX1N) U5.5(IN4) U5.6(OUT4)
HTX1P: HDMI.4 U1.H2(HTX1P) U5.4(IN3) U5.7(OUT3)
HTX2N: HDMI.3 U1.J2(HTX2N) U5.2(IN2) U5.9(OUT2)
HTX2P: HDMI.1 U1.J1(HTX2P) U5.1(IN1) U5.10(OUT1)
HTXCN: HDMI.12 U1.E2(HTXCN) U6.5(IN4) U6.6(OUT4)
HTXCP: HDMI.10 U1.F2(HTXCP) U6.4(IN3) U6.7(OUT3)
KEYADC: ANALOG.2 C79.2 D5.A R25.1 U1.AA5(KEYADC)
LINEINL: GPIO-2.34 U1.V1(LINEINL)
LINEINR: GPIO-2.36 U1.W1(LINEINR)
LINEOUTL: GPIO-2.38 U1.AA3(LINEOUTL)
LINEOUTR: GPIO-2.40 U1.Y3(LINEOUTR)
MBIAS: GPIO-2.24 U1.W3(MBIAS)
MICIN1N: GPIO-2.28 U1.Y1(MICIN1N)
MICIN1P: GPIO-2.26 U1.W2(MICIN1P)
MICIN2N: GPIO-2.32 U1.AA2(MICIN2N)
MICIN2P: GPIO-2.30 U1.Y2(MICIN2P)
N0ALE: U1.C16(PC1/NAND_ALE/SPI0_MISO) U4.17(ALE)
N0CE0: U1.F16(PC4/NAND_CE0) U4.9(#CE)
N0CE1: U1.B15(PC3/NAND_CE1/SPI0_CS) U4.10(NC)
N0CLE: U1.B16(PC2/NAND_CLE/SPI0_CLK) U4.16(CLE)
N0DQ0: U1.B18(PC8/NAND_DQ0/SDC2_D0) U4.29(I/O0)
N0DQ1: U1.C17(PC9/NAND_DQ1/SDC2_D1) U4.30(I/O1)
N0DQ2: U1.D17(PC10/NAND_DQ2/SDC2_D2) U4.31(I/O2)
N0DQ3: U1.C18(PC11/NAND_DQ3/SDC2_D3) U4.32(I/O3)
N0DQ4: U1.B17(PC12/NAND_DQ4/SDC2_D4) U4.41(I/O4)
N0DQ5: U1.B19(PC13/NAND_DQ5/SDC2_D5) U4.42(I/O5)
N0DQ6: U1.F17(PC14/NAND_DQ6/SDC2_D6) U4.43(I/O6)
N0DQ7: U1.C19(PC15/NAND_DQ7/SDC2_D7) U4.44(I/O7)
N0DQS: U1.H16(PC16/NAND_DQS/SDC2_RST) U4.35(NC)
N0RB0: R13.2 R16.2 U1.E16(PC6/NAND_RB0/SDC2_CMD) U4.7(R/#B)
N0RB1: R14.2 R15.1 U1.A16(PC7/NAND_RB1) U4.4(NC) U4.5(NC)
N0RBX: R15.2 R16.1 U4.6(NC)
N0RE: U1.A17(PC5/NAND_RE/SDC2_CLK) U4.8(#RE)
N0WE: U1.C15(PC0/NAND_WE/SPI0_MOSI) U4.18(#WE)
N$1: MICRO_SD.5(CLK/SCLK) R22.1
N$2: R11.2 U1.V10(SZQ)
N$3: R5.2 U3.L8(ZQ)
N$4 [pwr]: D2.C R47.1
N$5: R6.2 U2.L8(ZQ)
N$6: R9.2 U3.L9(NC)
N$7: D1.C UART0-DBG.2
N$8: R7.2 U1.AA19(SCK)
N$9: R8.2 U1.AA20(SCKB)
N$10: R37.1 U1.B2(JTAG-SEL1)
N$11: R10.2 U2.L9(NC)
N$12: L3.2 USB_OTG.GND1 USB_OTG.GND2 USB_OTG.GND3 USB_OTG.GND4
N$13: HDMI.19 R83.2
N$14: C75.2 U1.Y4(VRA1)
N$20: R53.2 U8.3(ISET)
N$24: R75.1 RESET.1
N$27: C93.1 C94.1 C95.1 L2.2 R51.2 U8.1(OUT)
N$28: FET1.3(D) HDMI.13 R46.1 R47.2
N$29: Q3.1(B) R76.2
N$31 [pwr]: C89.2 C90.2 LAN.GND1 LAN.GND2
N$33: L6.1 U12.3(LX)
N$34: R36.1 U1.A1(JTAG-SEL0)
N$36: R39.1 U1.T5(TEST)
N$39: R60.2 R64.2 U11.5(SET)
N$41: R40.1 U1.L5(PLLTEST)
N$42: C107.2 R61.2 R65.1 U12.5(FB)
N$45: C122.2 R76.1 R78.1
N$47: C125.2 U14.1(BS)
N$48: L8.1 U13.3(LX)
N$49: C115.2 R67.2 R68.1 U13.5(FB)
N$50: C125.1 L11.1 U14.6(LX)
N$51: PWR_LED.A R74.2
N$52: C134.2 R79.1 R80.1 U14.3(FB)
N$53: LAN.KG R44.1
N$55: R42.1 U1.F6(EPHY_RTX)
N$56: C85.2 LAN.3(COM)
N$57: LAN.KY R45.1
N$58: MICRO_SD.10(PACK1) MICRO_SD.11(PACK2) MICRO_SD.12(PACK3) MICRO_SD.13(PACK4) R23.1
N$64: C131.1 C132.1 FET3.2(S) L10.1 VR2.5(VOUT)
N$86: C83.2 Q2.4 R41.1 U1.V5(X32KIN)
N$101: R58.2 U9.3(ISET)
N$111: C102.1 L4.2 USB_HOST.1.1
N$116: C84.2 Q2.1 R41.2 U1.U4(X32KOUT)
N$122: C77.2 C78.2 U1.V4(VRP)
N$137: R63.2 U10.3(ISET)
N$176: C76.2 R24.1 U1.W5(VRA2)
N$192: C99.1 C100.1 C101.1 L4.1 U9.1(OUT)
N$193: L7.2 USB_HOST.GND1 USB_HOST.GND2 USB_HOST.GND3 USB_HOST.GND4
N$194: C113.1 L5.2 USB_HOST.2.1
N$195: C110.1 C111.1 C112.1 L5.1 U10.1(OUT)
N$231: R73.2 STAT.A
NWP: C64.2 R18.2 U4.19(#WP)
PA0/UART2-TX: U1.D11(PA0/UART2_TX/JTAG_MS0/PA_EINT0) UEXT.3
PA1/UART2-RX: R27.2 U1.D5(PA1/UART2_RX/JTAG_CK0/PA_EINT1) UEXT.4
PA2/STATUS-LED [pwr]: STAT.C U1.D6(PA2/UART2_RTS/JTAG_DO0/PA_EINT2)
PA3/USB2-DRV [pwr]: R62.2 U1.E13(PA3/UART2_CTS/JTAG_DI0/PA_EINT3) U10.4(EN)
PA4/UART0-TX: U1.F5(PA4/UART0_TX/PA_EINT4) UART0-DBG.1
PA5/UART0-RX: D1.A R12.1 U1.H6(PA5/UART0_RX/PWM0/PA_EINT5)
PA6: GPIO-2.4 U1.E14(PA6/SIM_PWREN/PWM1/PA_EINT6)
PA7: GPIO-2.6 U1.D8(PA7/SIM_CLK/PA_EINT7)
PA8: GPIO-2.8 U1.F13(PA8/SIM_DATA/PA_EINT8)
PA9: GPIO-2.10 U1.D13(PA9/SIM_RST/PA_EINT9)
PA10: GPIO-2.12 U1.E11(PA10/SIM_DET/PA_EINT10)
PA11/TWI0-SCK: R26.2 U1.F11(PA11/TWI0_SCK/DI_TX/PA_EINT11) UEXT.5
PA12/TWI0-SDA: R28.2 U1.C13(PA12/TWI0_SDA/DI_RX/PA_EINT12) UEXT.6
PA13/SPI1-CS: R29.2 U1.E15(PA13/SPI1_CS/UART3_TX/PA_EINT13) UEXT.10
PA14/SPI1-CLK: U1.G12(PA14/SPI1_CLK/UART3_RX/PA_EINT14) UEXT.9
PA15/SPI1-MOSI: U1.F14(PA15/SPI1_MOSI/UART3_RTS/PA_EINT15) UEXT.8
PA16/SPI1-MISO: U1.D15(PA16/SPI1_MISO/UART3_CTS/PA_EINT16) UEXT.7
PA17: GPIO-2.14 U1.C14(PA17/SPDIF_OUT(OWA_OUT)/PA_EINT17)
PA18/TWI1-SCK: GPIO-2.16 R34.2 U1.B13(PA18/PCM0_SYNC/TWI1_SCK/PA_EINT18)
PA19/TWI1-SDA: GPIO-2.18 R35.2 U1.B14(PA19/PCM0_CLK/TWI1_SDA/PA_EINT19)
PA20: GPIO-2.20 U1.A13(PA20/PCM0_DOUT/SIM_VPPEN/PA_EINT20)
PA21: GPIO-2.22 U1.A14(PA21/PCM0_DIN/SIM_VPPPP/PA_EINT21)
PD0: GPIO-1.5 U1.C21(PD0/RGMII_RXD3/MII_RXD3/RMII_NULL/DI_TX)
PD1: GPIO-1.7 U1.H17(PD1/RGMII_RXD2/MII_RXD2/RMII_NULL/DI_RX)
PD2: GPIO-1.9 U1.B20(PD2/RGMII_RXD1/MII_RXD1/RMII_RXD1)
PD3: GPIO-1.11 U1.H18(PD3/RGMII_RXD0/MII_RXD0/RMII_RXD0)
PD4: GPIO-1.13 U1.A20(PD4/RGMII_RXCK/MII_RXCK/RMII_NULL)
PD5: GPIO-1.15 U1.F19(PD5/RGMII_RXCTL/MII_RXDV/RMII_CRS_DV)
PD6: GPIO-1.17 U1.B21(PD6/RGMII_NULL/MII_RXERR/RMII_RXER)
PD7: GPIO-1.19 U1.E18(PD7/RGMII_TXD3/MII_TXD3/RMII_NULL)
PD8: GPIO-1.21 U1.E20(PD8/RGMII_TXD2/MII_TXD2/RMII_NULL)
PD9: GPIO-1.23 U1.F21(PD9/RGMII_TXD1/MII_TXD1/RMII_TXD1)
PD10: GPIO-1.25 U1.H19(PD10/RGMII_TXD0/MII_TXD0/RMII_TXD0)
PD11: GPIO-1.27 U1.F20(PD11/RGMII_NULL/MII_CRS/RMII_NULL)
PD12: GPIO-1.29 U1.E19(PD12/RGMII_TXCK/MII_TXCK/RMII_TXCK)
PD13: GPIO-1.31 U1.K17(PD13/RGMII_TXCTL/MII_TXEN/RMII_TXEN)
PD14: GPIO-1.33 U1.L17(PD14/RGMII_NULL/MII_TXERR/RMII_NULL)
PD15: GPIO-1.35 U1.K18(PD15/RGMII_CLKIN/MII_COL/RMII_NULL)
PD16: GPIO-1.37 U1.L18(PD16/MDC)
PD17: GPIO-1.39 U1.L19(PD17/MDIO)
PE0: GPIO-2.9 U1.B10(PE0/CSI_PCLK/TS_CLK)
PE1: GPIO-2.11 U1.A10(PE1/CSI_MCLK/TS_ERR)
PE2: GPIO-2.13 U1.B11(PE2/CSI_HSYNC/TS_SYNC)
PE3: GPIO-2.15 U1.C10(PE3/CSI_VSYNC/TS_DVLD)
PE4: GPIO-2.17 U1.C9(PE4/CSI_D0/TS_D0)
PE5: GPIO-2.19 U1.E10(PE5/CSI_D1/TS_D1)
PE6: GPIO-2.21 U1.D10(PE6/CSI_D2/TS_D2)
PE7: GPIO-2.23 U1.C8(PE7/CSI_D3/TS_D3)
PE8: GPIO-2.25 U1.C11(PE8/CSI_D4/TS_D4)
PE9: GPIO-2.27 U1.C12(PE9/CSI_D5/TS_D5)
PE10: GPIO-2.29 U1.E8(PE10/CSI_D6/TS_D6)
PE11: GPIO-2.31 U1.A11(PE11/CSI_D7/TS_D7)
PE12/TWI2-SCK: GPIO-2.33 R31.2 U1.B12(PE12/CSI_SCK/TWI2_SCK)
PE13/TWI2-SDA: GPIO-2.35 R30.2 U1.C7(PE13/CSI_SDA/TWI2_SDA)
PE14: GPIO-2.37 U1.C6(PE14)
PE15: GPIO-2.39 U1.C5(PE15)
PG0: GPIO-1.14 U1.J3(PG0/SDC1_CLK/PG_EINT0)
PG1: GPIO-1.16 U1.L2(PG1/SDC1_CMD/PG_EINT1)
PG2: GPIO-1.18 U1.H4(PG2/SDC1_D0/PG_EINT2)
PG3: GPIO-1.20 U1.F3(PG3/SDC1_D1/PG_EINT3)
PG4: GPIO-1.22 U1.C2(PG4/SDC1_D2/PG_EINT4)
PG5: GPIO-1.24 U1.C1(PG5/SDC1_D3/PG_EINT5)
PG6/UART1_TX: GPIO-1.26 U1.G4(PG6/UART1_TX/PG_EINT6)
PG7/UART1_RX: GPIO-1.28 U1.D3(PG7/UART1_RX/PG_EINT7)
PG8: GPIO-1.30 U1.C3(PG8/UART1_RTS/PG_EINT8)
PG9: GPIO-1.32 U1.E3(PG9/UART1_CTS/PG_EINT9)
PG10: GPIO-1.34 U1.M3(PG10/PCM1_SYNC/PG_EINT10)
PG11: GPIO-1.36 U1.D2(PG11/PCM1_CLK/PG_EINT11)
PG12: GPIO-1.38 U1.D1(PG12/PCM1_DOUT/PG_EINT12)
PG13: GPIO-1.40 U1.B1(PG13/PCM1_DIN/PG_EINT13)
PL0/S-SCK: GPIO-2.5 R33.2 U1.N1(PL0/S_TWI_SCK/S_PL_EINT0)
PL1/S-SDA: GPIO-2.7 R32.2 U1.M1(PL1/S_TWI_SDA/S_PL_EINT1)
PL2/USB1-DRV [pwr]: R57.2 U1.P2(PL2/S_UART_TX/S_PL_EINT2) U9.4(EN)
PL3/POWER-KEY: D5.C PWR_BUT.1 R72.2 U1.R1(PL3/S_UART_RX/S_PL_EINT3)
PL4/RECOVERY: R71.2 RECOVERY.1 U1.N2(PL4/S_JTAG_MS/S_PL_EINT4)
PL5/VCC-IO-EN: FET3.1(G) R81.1 U1.R2(PL5/S_JTAG_CK/S_PL_EINT5)
PL6/USB0-IDDET: U1.T4(PL6/S_JTAG_DO/S_PL_EINT6) USB_OTG.ID
PL7/USB0-VBUSDET: C92.1 R51.1 R54.2 U1.T3(PL7/S_JTAG_DI/S_PL_EINT7)
PL10/PWR-LED [pwr]: PWR_LED.C U1.V2(PL10/S_PWM/S_PL_EINT10)
PL11/USB0-DRV: R52.2 U1.U2(PL11/S_CIR_RX/S_PL_EINT11) U8.4(EN)
PWR-DRAM [pwr]: R59.2 U1.M6(PL9/S_PL_EINT9) U12.1(EN)
PWR-STB [pwr]: R66.2 U1.T2(PL8/S_PL_EINT8) U13.1(EN) U14.4(EN) VR1.3(CE)
S0BA0: U1.W17(SBA0) U2.M2(BA0) U3.M2(BA0)
S0BA1: U1.T18(SBA1) U2.N8(BA1) U3.N8(BA1)
S0BA2: U1.V17(SBA2) U2.M3(BA2) U3.M3(BA2)
S0CASN: U1.U15(SCAS) U2.K3(#CAS) U3.K3(#CAS)
S0CKE0: U1.AA21(SCKE0) U2.K9(CKE) U3.K9(CKE)
S0CKE1: U1.Y21(SCKE1) U2.J9(NC) U3.J9(NC)
S0CLK: R4.2 R7.1 U2.J7(CK) U3.J7(CK)
S0CLKN: R4.1 R8.1 U2.K7(#CK) U3.K7(#CK)
S0DDR3_RST: R3.1 U1.U16(SRST) U2.T2(#RESET) U3.T2(#RESET)
S0DQ0: U1.N20(SDQ0) U2.F8(DQL3)
S0DQ1: U1.P21(SDQ1) U2.F7(DQL1)
S0DQ2: U1.P20(SDQ2) U2.F2(DQL2)
S0DQ3: U1.U21(SDQ3) U2.H7(DQL7)
S0DQ4: U1.R19(SDQ4) U2.E3(DQL0)
S0DQ5: U1.T20(SDQ5) U2.H3(DQL4)
S0DQ6: U1.U19(SDQ6) U2.G2(DQL6)
S0DQ7: U1.U20(SDQ7) U2.H8(DQL5)
S0DQ8: U1.J19(SDQ8) U2.A7(DQU4)
S0DQ9: U1.H20(SDQ9) U2.C8(DQU2)
S0DQ10: U1.H21(SDQ10) U2.B8(DQU6)
S0DQ11: U1.J21(SDQ11) U2.D7(DQU0)
S0DQ12: U1.L20(SDQ12) U2.C3(DQU1)
S0DQ13: U1.L21(SDQ13) U2.C2(DQU3)
S0DQ14: U1.M21(SDQ14) U2.A2(DQU5)
S0DQ15: U1.M19(SDQ15) U2.A3(DQU7)
S0DQ16: U1.Y17(SDQ16) U3.H8(DQL5)
S0DQ17: U1.AA17(SDQ17) U3.H7(DQL7)
S0DQ18: U1.Y16(SDQ18) U3.F8(DQL3)
S0DQ19: U1.W15(SDQ19) U3.F7(DQL1)
S0DQ20: U1.Y14(SDQ20) U3.G2(DQL6)
S0DQ21: U1.AA14(SDQ21) U3.H3(DQL4)
S0DQ22: U1.Y13(SDQ22) U3.E3(DQL0)
S0DQ23: U1.Y12(SDQ23) U3.F2(DQL2)
S0DQ24: U1.W12(SDQ24) U3.D7(DQU0)
S0DQ25: U1.AA11(SDQ25) U3.C8(DQU2)
S0DQ26: U1.Y11(SDQ26) U3.B8(DQU6)
S0DQ27: U1.Y10(SDQ27) U3.A7(DQU4)
S0DQ28: U1.W9(SDQ28) U3.C3(DQU1)
S0DQ29: U1.AA8(SDQ29) U3.A3(DQU7)
S0DQ30: U1.Y8(SDQ30) U3.C2(DQU3)
S0DQ31: U1.Y7(SDQ31) U3.A2(DQU5)
S0ODT0: U1.W11(SODT0) U2.K1(ODT) U3.K1(ODT)
S0ODT1: U1.V11(SODT1) U2.J1(NC) U3.J1(NC)
S0RASN: U1.V13(SRAS) U2.J3(#RAS) U3.J3(#RAS)
S0SA0: U1.T17(SA0) U2.N3(A0) U3.N3(A0)
S0SA1: U1.U18(SA1) U2.P7(A1) U3.P7(A1)
S0SA2: U1.V19(SA2) U2.P3(A2) U3.P3(A2)
S0SA3: U1.V20(SA3) U2.N2(A3) U3.N2(A3)
S0SA4: U1.V21(SA4) U2.P8(A4) U3.P8(A4)
S0SA5: U1.Y19(SA5) U2.P2(A5) U3.P2(A5)
S0SA6: U1.Y20(SA6) U2.R8(A6) U3.R8(A6)
S0SA7: U1.V15(SA7) U2.R2(A7) U3.R2(A7)
S0SA8: U1.W18(SA8) U2.T8(A8) U3.T8(A8)
S0SA9: U1.Y18(SA9) U2.R3(A9) U3.R3(A9)
S0SA10: U1.P19(SA10) U2.L7(A10/AP) U3.L7(A10/AP)
S0SA11: U1.N19(SA11) U2.R7(A11) U3.R7(A11)
S0SA12: U1.R18(SA12) U2.N7(A12/#BC) U3.N7(A12/#BC)
S0SA13: U1.V12(SA13) U2.T3(A13) U3.T3(A13)
S0SA14: U1.N17(SA14) U2.T7(NC/A14) U3.T7(NC/A14)
S0SA15: U1.R17(SA15) U2.M7(NC) U3.M7(NC)
S0SCS0: U1.W20(SCS0) U2.L2(#CS) U3.L2(#CS)
S0SCS1: U1.W21(SCS1) U2.L1(NC) U3.L1(NC)
S0SDQM0: U1.M20(SDQM0) U2.E7(DML)
S0SDQM1: U1.G20(SDQM1) U2.D3(DMU)
S0SDQM2: U1.AA18(SDQM2) U3.E7(DML)
S0SDQM3: U1.AA12(SDQM3) U3.D3(DMU)
S0SDQS0: U1.R20(SDQS0) U2.F3(DQSL)
S0SDQS0_N: U1.R21(SDQS0B) U2.G3(#DQSL)
S0SDQS1: U1.K20(SDQS1) U2.C7(DQSU)
S0SDQS1_N: U1.J20(SDQS1B) U2.B7(#DQSU)
S0SDQS2: U1.AA15(SDQS2) U3.F3(DQSL)
S0SDQS2_N: U1.Y15(SDQS2B) U3.G3(#DQSL)
S0SDQS3: U1.AA9(SDQS3) U3.C7(DQSU)
S0SDQS3_N: U1.Y9(SDQS3B) U3.B7(#DQSU)
S0VREF: C1.2 C9.2 C42.2 C52.2 C57.2 R1.1 R2.2 U1.T16(SVREF) U2.H1(VREFDQ) U2.M8(VREFCA) U3.H1(VREFDQ) U3.M8(VREFCA)
S0WEN: U1.W13(SWE) U2.L3(#WE) U3.L3(#WE)
SD0-CLK: R22.2 U1.D20(PF2/SDC0_CLK/UART0_TX)
SD0-CMD: MICRO_SD.3(CMD/DI) R20.1 U1.F18(PF3/SDC0_CMD/JTAG_DO0)
SD0-D0: MICRO_SD.7(DAT0/DO) RM1.4.1 U1.A19(PF1/SDC0_D0/JTAG_DI0)
SD0-D1: MICRO_SD.8(DAT1/RES) RM1.3.1 U1.D19(PF0/SDC0_D1/JTAG_MS0)
SD0-D2: MICRO_SD.1(DAT2/RES) RM1.1.1 U1.C20(PF5/SDC0_D2/JTAG_CK0)
SD0-D3: MICRO_SD.2(CD/DAT3/CS) R19.1 U1.E21(PF4/SDC0_D3/UART0_RX)
SD0-DET#: MICRO_SD.9(CP_E) RM1.2.1 U1.G18(PF6/SDC0_DET)
SD_VCC: C67.2 L1.2 MICRO_SD.4(VDD)
TVOUT: GPIO-2.3 U1.F10(TVOUT)
UBOOT: R70.2 U1.W6(UBOOT) UBOOT.1
UDM0: U1.B5(USB_DM0) USB_OTG.D-
UDM1: U1.B7(USB_DM1) USB_HOST.1.2
UDM2: U1.A8(USB_DM2) USB_HOST.2.2
UDM3: GPIO-1.10 U1.B9(USB_DM3)
UDP0: U1.A5(USB_DP0) USB_OTG.D+
UDP1: U1.B6(USB_DP1) USB_HOST.1.3
UDP2: U1.A7(USB_DP2) USB_HOST.2.3
UDP3: GPIO-1.8 U1.B8(USB_DP3)
V+: 1.5V.1(PP) C1.1 C2.1 C3.1 C4.2 C5.2 C6.2 C7.2 C8.2 C10.2 C11.2 C12.2 C13.2 C14.2 C15.2 C16.2 C17.2 C18.2 C19.2 C20.2 C21.2 C22.2 C23.2 C24.2 C25.2 C26.2 C27.2 C33.2 C34.2 C35.2 C36.2 C37.2 C38.2 C39.2 C40.2 C41.2 C43.2 C44.2 C45.2 C46.2 C47.2 C48.2 C49.2 C50.2 C51.2 C107.1 C108.1 C109.1 L6.2 R1.2 R3.2 R61.1 U1.L16(VCC-DRAM) U1.M16(VCC-DRAM) U1.N16(VCC-DRAM) U1.P16(VCC-DRAM) U1.P17(VCC-DRAM) U1.R16(VCC-DRAM) U1.T12(VCC-DRAM) U1.T13(VCC-DRAM) U1.T14(VCC-DRAM) U1.T15(VCC-DRAM) U1.U11(VCC-DRAM) U2.A1(VDDQ) U2.A8(VDDQ) U2.B2(VDD) U2.C1(VDDQ) U2.C9(VDDQ) U2.D2(VDDQ) U2.D9(VDD) U2.E9(VDDQ) U2.F1(VDDQ) U2.G7(VDD) U2.H2(VDDQ) U2.H9(VDDQ) U2.K2(VDD) U2.K8(VDD) U2.N1(VDD) U2.N9(VDD) U2.R1(VDD) U2.R9(VDD) U3.A1(VDDQ) U3.A8(VDDQ) U3.B2(VDD) U3.C1(VDDQ) U3.C9(VDDQ) U3.D2(VDDQ) U3.D9(VDD) U3.E9(VDDQ) U3.F1(VDDQ) U3.G7(VDD) U3.H2(VDDQ) U3.H9(VDDQ) U3.K2(VDD) U3.K8(VDD) U3.N1(VDD) U3.N9(VDD) U3.R1(VDD) U3.R9(VDD) ; supply symbol labelled 1.5V
VCC [pwr]: 3.3V.1(PP) C60.1 C61.2 C62.2 C63.2 C65.2 C66.2 C70.2 C71.2 C88.2 C121.1 C122.1 C127.1 D2.A FET1.1(G) FET3.3(D) GPIO-1.3 L1.1 L9.2 LAN.AG LAN.AY R12.2 R13.1 R14.1 R17.1 R18.1 R19.2 R20.2 R26.1 R27.1 R28.1 R29.1 R30.1 R31.1 R32.1 R33.1 R34.1 R35.1 R43.2 RM1.1.2 RM1.2.2 RM1.3.2 RM1.4.2 U1.G7(EPHY_VCC) U1.G10(VDD_EFUSE) U1.G11(VCC_USB) U1.G13(VCC_IO) U1.G14(VCC_IO) U1.G15(VCC_IO) U1.H7(VCC_PG) U1.H13(VCC_IO) U1.H14(VCC_IO) U1.J6(HVCC) U1.J14(VCC_IO) U1.J15(VCC_PD) U4.1(NC) U4.12(VCC) U4.24(NC) U4.34(NC) U4.37(VCC) U4.39(NC) UEXT.1 ; supply symbol labelled 3.3V
VCC/2: 1.3V.1(PP) C53.1 C54.1 C55.2 C56.2 C129.1 C130.1 L11.2 R77.1 U1.N8(VDD_CPUX) U1.P6(VDD_CPUX) U1.P7(VDD_CPUX) U1.P8(VDD_CPUX) U1.P9(VDD_CPUX) U1.R6(VDD_CPUX) U1.R7(VDD_CPUX) U1.R8(VDD_CPUX) U1.T6(VDD_CPUX) U1.T7(VDD_CPUX) U1.T8(VDD_CPUX) U1.U6(VDD_CPUX) U1.U9(VDD_CPUX) ; supply symbol labelled 1.3V_CPU
VCCINT: 1.1V_CPUS.1(PP) C58.1 C59.2 C69.1 C104.1 R60.1 U1.J7(VDD_CPUS) U1.J8(VDD_CPUS) U1.M4(RTC_VIO) U11.4(VOUT) ; supply symbol labelled 1.1V_CPUS
VDD: 1.2V.1(PP) C28.1 C29.2 C30.2 C31.2 C32.2 C115.1 C116.1 C117.1 L8.2 R67.1 U1.F8(EPHY_VDD) U1.H10(VDD_SYS) U1.J10(VDD_SYS) U1.J11(VDD_SYS) U1.J12(VDD_SYS) U1.K10(VDD_SYS) U1.K11(VDD_SYS) U1.K12(VDD_SYS) U1.L10(VDD_SYS) U1.L11(VDD_SYS) U1.L12(VDD_SYS) U1.L13(VDD_SYS) U1.L14(VDD_SYS) ; supply symbol labelled 1.2V_SYS
VDD-CPUFB: R82.1(1.1) U1.T10(VDD_CPUFB)
VDD-CPUFB1: C134.1 R77.2 R80.2 R82.2(1.2)
VDD_EFUSEBP: C68.1 U1.H11(VDD_EFUSEBP)
VPP [pwr]: ANALOG.1 C73.2 C74.2 C119.1 C120.1 L9.1 R25.2 U1.G9(V33_TV) U1.N3(VCC_PLL) U1.V3(AVCC) VR1.5(VOUT) ; supply symbol labelled 3.3VA
VPS: R17.2 R21.1 U4.38(NC)
X32KFOUT: GPIO-1.12 U1.P3(X32KFOUT)
XTALI: C81.2 Q1.2 U1.K2(X24MIN)
XTALO: C82.2 Q1.1 U1.K1(X24MOUT)
Unconnected: HDMI.14 LAN.6(NC) U1.K4(NC) U4.3(NC) U4.11(NC) U4.14(NC) U4.15(NC) U4.20(NC) U4.21(NC) U4.22(NC) U4.26(NC) U4.27(NC) U4.28(NC) U4.33(NC) U4.40(NC) U4.45(NC) U4.46(NC) U4.47(NC)

## Buses
S0SA[0..14]
S0DQ[0..31]
S0BA[0..2],S0CLK,S0CLKN,S0CKE0,S0CKE1,S0CASN,S0RASN,S0WEN,S0SDQM[0..3],S0SDQS[0..3],S0SDQS0_N,S0SDQS1_N,S0SDQS2_N,S0SDQS3_N,S0DDR3_RST,S0ODT0,S0ODT1,S0SCS0,S0SCS1,S0SA15
N0DQ[0..7],N0WE,N0ALE,N0CLE,N0CE0,N0CE1,N0RE,N0RB[0..1]
HTX0P,HTX0N,HTX1P,HTX1N,HTX2P,HTX2N,HTXCP,HTXCN,HSCL,HSDA,HHPD,HCEC
UDP[0..2],UDM[0..2],+5V_OTG_PWR
EPHY_LINK_LED,EPHY_SPD_LED,EPHY_TXP,EPHY_TXN,EPHY_RXP,EPHY_RXN
PD[0..17]
PG[0..5],PG6/UART1_TX,PG7/UART1_RX,PG[8..13],PE[0..11],PE12/TWI2-SCK,PE13/TWI2-SDA,PE[14..15]
B$1
PA0/UART2-TX,PA1/UART2-RX,PA4/UART0-TX,PA5/UART0-RX,PA[6..10]

## Notes on the sheet
- ALLWINNER  H3 ANDROID/LINUX   BİLGİSAYAR 4K MONITOR
- DDR3 RAM
- 1. Use 2(DDR3 256Mx16 Memory chips)x4Gb = 1GByte, i.e. 2xH5TQ4G63MFR-PBC(or K4B4G1646D-BCK0)  -> Default
- 2. Use 2(DDR3 512Mx16 Memory chips)x8Gb = 2GBytes, i.e. 2xH5TC8G63AMR-PBA(or K4B8G1646Q-MYK0)
- Debug UART | Option:
- 32Gb (4096M x 8bit)
- MicroSD
- 4G Bytes NAND Flash
- Note: To be mounted for the prototypes!!!
- Extensions
- ???
- HDMI | Ethernet
- MODE
- PWRON/WORK | STANDBY | PWROFF
- STATE
- PWR-STB | 1 | 0 | 0
- PWR-DRAM | 1 | 1 | 0
- Fiducials:
- USB-OTG
- ANA SİSTEM REGULATORÜ
- =======================
- The power options are:
- =======================
- Iset = 6800/Rs | Rs
- 1. +5V_OTG_PWR via USB_OTG | Iset = 523mA
- (External 5VDC driven by any USB)
- 2. +5V via UART0-DBG header
- USB-HOSTs
- (External 5VDC power source)
- 3. 5VEXT via GPIO-2
- Rs
- Iset = 6800/Rs
- Iset = 1000mA
- (External 5VDC power source)
- Ra
- Re
- Rs
- Rb
- Iset = 6800/Rs
- Vout=0.8*(1+Ra/Rb) | Iset = 523mA
- Rf
- Vout=0.6x(1+Re/Rf)
- Buttons | LEDs
- Rc
- Rd
- Vout=0.6x(1+Rf/Rd)
- Rh | Rg
- Vout=0.6x(1+Rg/Rh)

## Library data of the parts
1.1V_CPUS 1.2V 1.3V 1.5V 3.3V +5V GND GND_PIN VCC-RTC = gogo:TESTPAD: drill 40mils, diameter 70mils
5V_E = jumper:SJ: SMD solder JUMPER
ANALOG = Penko:CON3
C1-C136 = rcl:C-EU: CAPACITOR, European symbol
D1-D3 D5 = gogo:SCHOTKKY7.62SS
D4 = OLIMEX_DISCRET:SMBJ16A
FET1 = Penko:N-MOS+DIOD
FET2 FET3 = Penko:P-MOS+DIOD
FID1-FID6 = SparkFunEagle-6-6-07:FIDUCIAL: Fiducial Alignment Points Various fiducial points for machine vision alignment.
FUSE = gogo:FUSE
GPIO-1 GPIO-2 = con-harting-ml:ML40: HARTING
HDMI = OLIMEX_CONNECTORS:HDMI-MC34931
L1-L5 L7 L9 L10 = rcl:L-US: INDUCTOR, American symbol
L6 L8 L11 = OLIMEX_DISCRET:L
LAN = OLIMEX_CONNECTORS:RJLBC-060TC1_GND
MICRO_SD = OLIMEX_CONNECTORS:MICRO_SD/MMC_CP_NEW
PWR_BUT RECOVERY RESET UBOOT = gogo:SW-TAKT
PWR_LED STAT = DOUBLE-SIDE:LED
Q1 Q2 = crystal:HC49/S: CRYSTAL
Q3 = semicon-smd-ipc:NPN-TRANSISTOR_: NPN TRANSISTOR
R1-R55 R57-R81 R83 = rcl:R-EU_: RESISTOR, European symbol
R56 R82 = OLIMEX_DISCRET:R_0R
RM1 = OLIMEX_DISCRET:R_MATRIX_4E
U1 = OLIMEX_IC:ALLWINNER-H3
U2 U3 = OLIMEX_IC:H5TQ2G63BFR_MEM4G16D3EABG-125
U4 = OLIMEX_IC:H27UBG8T2A
U5-U7 = OLIMEX_IC:RCLAMP0524P
U8-U10 = OLIMEX_IC:SY6280
U11 = OLIMEX_DISCRET:APL5315: APL5315 According to APL5315.pdf datasheet by Nikolay The APL5315 is a P-channel low dropout linear regulator which needs only one input voltage from 2.8~6V , and delivers current up to 300mA to set output voltage; Features Wide Operating Voltage: 2.8~6V Low Dropout Voltage: 230mV(typical) @ 300mA Guaranteed 300mA Output Current Two Modes for Setting Output Voltage: - Fixed Output V oltage: 1~5V - Adjustable Output V oltage: 0.8~5.5V Current Limit Protection with Foldback Current Internal Soft-Start Over T emperature Protection Stable with Low ESR Ceriamic Capacitor SOT-23-5 Package Lead Free and Green Devices Available (RoHS Compliant)
U12 U13 = OLIMEX_IC:SY8008
U14 = OLIMEX_IC:SY8113ADC
UART0-DBG = Penko:CON5
UEXT = con-harting-ml:ML10: HARTING
USB_HOST = OLIMEX_CONNECTORS:USB_TWO_LEVEL
USB_OTG = OLIMEX_CONNECTORS:MINI_USB9
VR1 VR2 = OLIMEX_DISCRET:AP1231